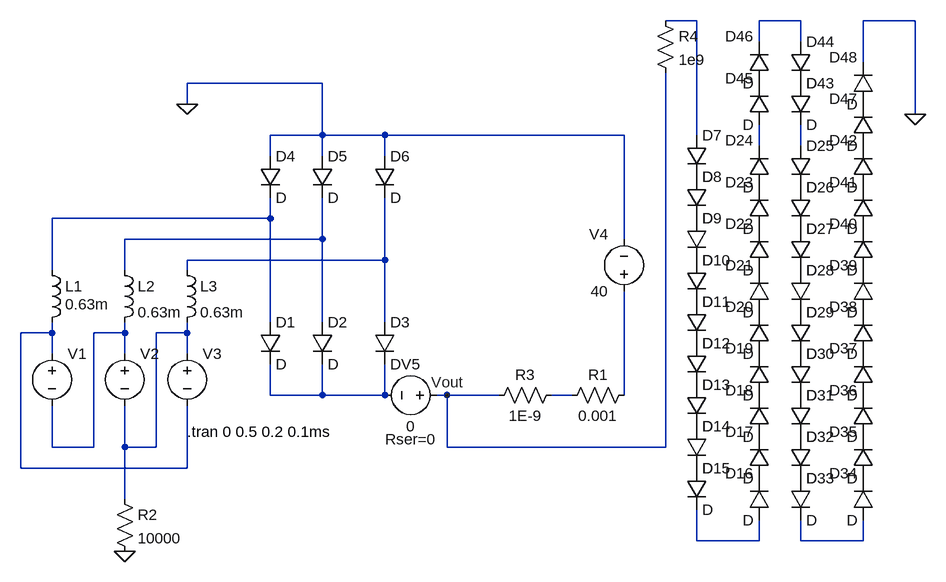
[diagram p0: schematic 3PhaseBatteryCharger.asc]
3PhaseBatteryCharger.asc, the LTspice schematic file:
Version 4
SHEET 1 1136 680
WIRE -208 416 -208 480
WIRE -96 560 -96 480
WIRE 0 512 0 416
WIRE 128 288 128 128
WIRE 208 288 208 160
WIRE 0 336 0 304
WIRE 304 96 304 192
WIRE 128 32 128 0
WIRE 128 0 208 0
WIRE 208 0 208 32
WIRE 208 0 304 0
WIRE 304 0 304 32
WIRE 128 352 128 400
WIRE 128 400 208 400
WIRE 208 400 208 352
WIRE 304 352 304 400
WIRE 304 400 208 400
WIRE 0 -48 0 -80
WIRE 0 -80 208 -80
WIRE 208 -80 208 0
WIRE 672 160 672 0
WIRE 672 0 304 0
WIRE 672 240 672 400
WIRE -208 288 -208 304
WIRE -96 288 -96 304
WIRE 0 208 0 192
WIRE 0 192 304 192
WIRE 304 192 304 288
WIRE -96 208 -96 160
WIRE -96 160 208 160
WIRE 208 160 208 96
WIRE -208 208 -208 128
WIRE -208 128 128 128
WIRE 128 128 128 96
WIRE -96 304 -144 304
WIRE -96 304 -96 336
WIRE -144 304 -144 480
WIRE -144 480 -208 480
WIRE -48 480 -48 304
WIRE -48 304 0 304
WIRE 0 304 0 288
WIRE -48 480 -96 480
WIRE -96 480 -96 416
WIRE 0 512 -256 512
WIRE -256 512 -256 304
WIRE -256 304 -208 304
WIRE -208 304 -208 336
WIRE 736 -176 784 -176
WIRE 784 -176 784 0
WIRE 784 576 784 624
WIRE 784 624 880 624
WIRE 880 624 880 592
WIRE 880 16 880 -16
WIRE 944 -16 944 16
WIRE 944 592 944 624
WIRE 944 624 1040 624
WIRE 1040 624 1040 592
WIRE 1120 -176 1120 -32
WIRE 736 -96 736 480
WIRE 736 480 400 480
WIRE 400 480 400 400
WIRE 400 400 480 400
WIRE 560 400 592 400
WIRE 880 -144 880 -176
WIRE 880 -176 944 -176
WIRE 944 -176 944 -144
WIRE 1040 -112 1040 -176
WIRE 1040 -176 1120 -176
WIRE 384 400 400 400
FLAG 0 -48 0
FLAG -96 640 0
FLAG 1120 -32 0
FLAG 400 400 Vout
SYMBOL diode 112 288 R0
SYMATTR InstName D1
SYMBOL diode 192 288 R0
SYMATTR InstName D2
SYMBOL diode 288 288 R0
SYMATTR InstName D3
SYMBOL diode 112 32 R0
SYMATTR InstName D4
SYMBOL diode 192 32 R0
SYMATTR InstName D5
SYMBOL diode 288 32 R0
SYMATTR InstName D6
SYMBOL voltage -208 320 R0
WINDOW 3 24 104 Invisible 0
WINDOW 123 0 0 Left 0
SYMATTR Value SINE(0 62.5 50 0 0 0)
SYMATTR InstName V1
SYMATTR SpiceLine Rser=0.005
SYMBOL voltage -96 320 R0
WINDOW 3 24 104 Invisible 0
WINDOW 123 0 0 Left 0
SYMATTR Value SINE(0 62.5 50 0 0 120)
SYMATTR InstName V2
SYMATTR SpiceLine Rser=0.005
SYMBOL voltage 0 320 R0
WINDOW 3 24 104 Invisible 0
WINDOW 123 0 0 Left 0
SYMATTR Value SINE(0 62.5 50 0 0 240)
SYMATTR InstName V3
SYMATTR SpiceLine Rser=0.005
SYMBOL ind -224 192 R0
WINDOW 3 36 68 Left 0
SYMATTR Value 0.63m
SYMATTR InstName L1
SYMATTR SpiceLine Rpar=1000
SYMBOL ind -112 192 R0
SYMATTR InstName L2
SYMATTR Value 0.63m
SYMATTR SpiceLine Rpar=1000
SYMBOL ind -16 192 R0
SYMATTR InstName L3
SYMATTR Value 0.63m
SYMATTR SpiceLine Rpar=1000
SYMBOL voltage 672 256 R180
WINDOW 0 24 104 Left 0
WINDOW 3 24 16 Left 0
WINDOW 123 0 0 Left 0
WINDOW 39 0 0 Left 0
SYMATTR InstName V4
SYMATTR Value 40
SYMBOL res -112 544 R0
SYMATTR InstName R2
SYMATTR Value 10000
SYMBOL diode 768 0 R0
SYMATTR InstName D7
SYMBOL diode 768 64 R0
SYMATTR InstName D8
SYMBOL diode 768 128 R0
SYMATTR InstName D9
SYMBOL diode 768 192 R0
SYMATTR InstName D10
SYMBOL diode 768 256 R0
SYMATTR InstName D11
SYMBOL diode 768 320 R0
SYMATTR InstName D12
SYMBOL diode 768 384 R0
SYMATTR InstName D13
SYMBOL diode 768 448 R0
SYMATTR InstName D14
SYMBOL diode 768 512 R0
SYMATTR InstName D15
SYMBOL diode 896 592 R180
WINDOW 0 24 72 Left 0
WINDOW 3 24 0 Left 0
SYMATTR InstName D16
SYMBOL diode 896 528 R180
WINDOW 0 24 72 Left 0
WINDOW 3 24 0 Left 0
SYMATTR InstName D17
SYMBOL diode 896 464 R180
WINDOW 0 24 72 Left 0
WINDOW 3 24 0 Left 0
SYMATTR InstName D18
SYMBOL diode 896 400 R180
WINDOW 0 24 72 Left 0
WINDOW 3 24 0 Left 0
SYMATTR InstName D19
SYMBOL diode 896 336 R180
WINDOW 0 24 72 Left 0
WINDOW 3 24 0 Left 0
SYMATTR InstName D20
SYMBOL diode 896 272 R180
WINDOW 0 24 72 Left 0
WINDOW 3 24 0 Left 0
SYMATTR InstName D21
SYMBOL diode 896 208 R180
WINDOW 0 24 72 Left 0
WINDOW 3 24 0 Left 0
SYMATTR InstName D22
SYMBOL diode 896 144 R180
WINDOW 0 24 72 Left 0
WINDOW 3 24 0 Left 0
SYMATTR InstName D23
SYMBOL diode 896 80 R180
WINDOW 0 24 72 Left 0
WINDOW 3 24 0 Left 0
SYMATTR InstName D24
SYMBOL diode 928 16 R0
SYMATTR InstName D25
SYMBOL diode 928 80 R0
SYMATTR InstName D26
SYMBOL diode 928 144 R0
SYMATTR InstName D27
SYMBOL diode 928 208 R0
SYMATTR InstName D28
SYMBOL diode 928 272 R0
SYMATTR InstName D29
SYMBOL diode 928 336 R0
SYMATTR InstName D30
SYMBOL diode 928 400 R0
SYMATTR InstName D31
SYMBOL diode 928 464 R0
SYMATTR InstName D32
SYMBOL diode 928 528 R0
SYMATTR InstName D33
SYMBOL diode 1056 592 R180
WINDOW 0 24 72 Left 0
WINDOW 3 24 0 Left 0
SYMATTR InstName D34
SYMBOL diode 1056 528 R180
WINDOW 0 24 72 Left 0
WINDOW 3 24 0 Left 0
SYMATTR InstName D35
SYMBOL diode 1056 464 R180
WINDOW 0 24 72 Left 0
WINDOW 3 24 0 Left 0
SYMATTR InstName D36
SYMBOL diode 1056 400 R180
WINDOW 0 24 72 Left 0
WINDOW 3 24 0 Left 0
SYMATTR InstName D37
SYMBOL diode 1056 336 R180
WINDOW 0 24 72 Left 0
WINDOW 3 24 0 Left 0
SYMATTR InstName D38
SYMBOL diode 1056 272 R180
WINDOW 0 24 72 Left 0
WINDOW 3 24 0 Left 0
SYMATTR InstName D39
SYMBOL diode 1056 208 R180
WINDOW 0 24 72 Left 0
WINDOW 3 24 0 Left 0
SYMATTR InstName D40
SYMBOL diode 1056 144 R180
WINDOW 0 24 72 Left 0
WINDOW 3 24 0 Left 0
SYMATTR InstName D41
SYMBOL diode 1056 80 R180
WINDOW 0 24 72 Left 0
WINDOW 3 24 0 Left 0
SYMATTR InstName D42
SYMBOL res 720 -192 R0
SYMATTR InstName R4
SYMATTR Value 1e9
SYMBOL res 688 384 R90
WINDOW 0 0 56 VBottom 0
WINDOW 3 32 56 VTop 0
SYMATTR InstName R1
SYMATTR Value 0.001
SYMBOL res 464 416 R270
WINDOW 0 32 56 VTop 0
WINDOW 3 0 56 VBottom 0
SYMATTR InstName R3
SYMATTR Value 1E-9
SYMBOL diode 928 -80 R0
SYMATTR InstName D43
SYMBOL diode 928 -144 R0
SYMATTR InstName D44
SYMBOL diode 896 -16 R180
WINDOW 0 24 72 Left 0
WINDOW 3 24 0 Left 0
SYMATTR InstName D45
SYMBOL diode 896 -80 R180
WINDOW 0 24 72 Left 0
WINDOW 3 24 0 Left 0
SYMATTR InstName D46
SYMBOL diode 1056 16 R180
WINDOW 0 24 72 Left 0
WINDOW 3 24 0 Left 0
SYMATTR InstName D47
SYMBOL diode 1056 -48 R180
WINDOW 0 24 72 Left 0
WINDOW 3 24 0 Left 0
SYMATTR InstName D48
SYMBOL voltage 400 400 R90
WINDOW 0 -32 56 VBottom 0
WINDOW 3 32 56 VTop 0
WINDOW 123 0 0 Left 0
WINDOW 39 52 56 VTop 0
SYMATTR InstName V5
SYMATTR Value 0
SYMATTR SpiceLine Rser=0
TEXT 0 456 Left 0 !.tran 0 0.5 0.2 0.1ms

The netlist it stands for:
* 3PhaseBatteryCharger.asc
D1 N004 N007 D
D2 N005 N007 D
D3 N006 N007 D
D4 0 N004 D
D5 0 N005 D
D6 0 N006 D
V1 N003 N001 SINE(0 62.5 50 0 0 0) Rser=0.005
V2 N001 N002 SINE(0 62.5 50 0 0 120) Rser=0.005
V3 N002 N003 SINE(0 62.5 50 0 0 240) Rser=0.005
L1 N004 N003 0.63m Rpar=1000
L2 N005 N001 0.63m Rpar=1000
L3 N006 N002 0.63m Rpar=1000
V4 N008 0 40
R2 N002 0 10000
D7 N009 P001 D
D8 P001 P002 D
D9 P002 P003 D
D10 P003 P004 D
D11 P004 P005 D
D12 P005 P006 D
D13 P006 P007 D
D14 P007 P008 D
D15 P008 N010 D
D16 N010 P009 D
D17 P009 P010 D
D18 P010 P011 D
D19 P011 P012 D
D20 P012 P013 D
D21 P013 P014 D
D22 P014 P015 D
D23 P015 P016 D
D24 P016 N011 D
D25 N012 P017 D
D26 P017 P018 D
D27 P018 P019 D
D28 P019 P020 D
D29 P020 P021 D
D30 P021 P022 D
D31 P022 P023 D
D32 P023 P024 D
D33 P024 N013 D
D34 N013 P025 D
D35 P025 P026 D
D36 P026 P027 D
D37 P027 P028 D
D38 P028 P029 D
D39 P029 P030 D
D40 P030 P031 D
D41 P031 P032 D
D42 P032 P033 D
R4 N009 Vout 1e9
R1 N008 N014 0.001
R3 Vout N014 1E-9
D43 P034 N012 D
D44 N015 P034 D
D45 N011 P035 D
D46 P035 N015 D
D47 P033 P036 D
D48 P036 0 D
V5 Vout N007 0 Rser=0
.model D D
.lib standard.dio
.tran 0 0.5 0.2 0.1ms
.backanno
.end